# Altium project MSE-Interface-N1.PrjPcb (part 1 of 2)
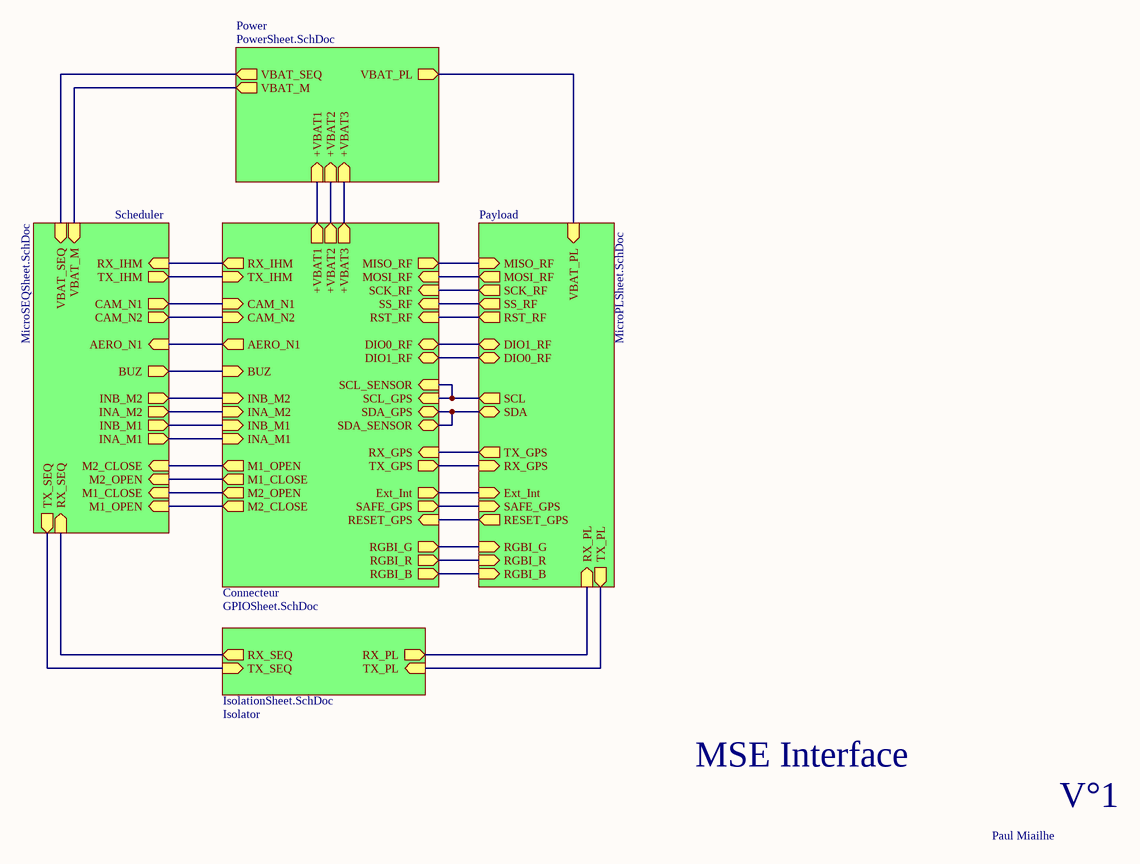
[diagram p0: MainSheet.SchDoc]
6 sheets, 73 parts. Net scope: hierarchical (ports join the sheet entries above them; power ports are global).
Board file: MSE-PCB-N1.PcbDoc
Sheets:
  MainSheet.SchDoc
    Payload = MicroPLSheet.SchDoc
    Connecteur = GPIOSheet.SchDoc
    Power = PowerSheet.SchDoc
    Scheduler = MicroSEQSheet.SchDoc
    Isolator = IsolationSheet.SchDoc

## Sheet MainSheet.SchDoc
size A4; SheetNumber: 1; SheetTotal: 6

### Sub-sheets
Connecteur = GPIOSheet.SchDoc: INA_M1 (in), INB_M1 (in), INA_M2 (in), INB_M2 (in), M1_OPEN (out), M1_CLOSE (out), M2_OPEN (out), M2_CLOSE (out), BUZ (in), +VBAT1 (out), +VBAT3 (out), +VBAT2 (out), AERO_N1 (out), SS_RF (in), RX_GPS (in), Ext_Int (out), SAFE_GPS (out), RESET_GPS (in), MISO_RF (out), MOSI_RF (in), RST_RF (in), SCK_RF (in), DIO0_RF (bidir), DIO1_RF (bidir), TX_GPS (out), SDA_GPS (bidir), SCL_GPS (in), RX_IHM (out), TX_IHM (in), CAM_N1 (in), CAM_N2 (in), SDA_SENSOR (bidir), SCL_SENSOR (in), RGBI_G (out), RGBI_R (out), RGBI_B (out)
Isolator = IsolationSheet.SchDoc: RX_PL (out), TX_PL (in), RX_SEQ (out), TX_SEQ (in)
Payload = MicroPLSheet.SchDoc: SS_RF (out), RX_GPS (in), Ext_Int (in), SAFE_GPS (in), RESET_GPS (out), MISO_RF (in), MOSI_RF (out), RST_RF (out), SCK_RF (out), DIO0_RF (bidir), DIO1_RF (bidir), TX_GPS (out), SDA (bidir), SCL (out), VBAT_PL (in), RX_PL (in), TX_PL (out), RGBI_G (in), RGBI_R (in), RGBI_B (in)
Power = PowerSheet.SchDoc: VBAT_SEQ (out), +VBAT1 (in), +VBAT3 (in), VBAT_PL (out), +VBAT2 (in), VBAT_M (out)
Scheduler = MicroSEQSheet.SchDoc: M1_OPEN (in), M1_CLOSE (in), M2_OPEN (in), M2_CLOSE (in), BUZ (out), INA_M1 (out), INB_M1 (out), INA_M2 (out), INB_M2 (out), VBAT_SEQ (in), VBAT_M (in), AERO_N1 (in), RX_SEQ (in), TX_SEQ (out), CAM_N1 (out), CAM_N2 (out), RX_IHM (in), TX_IHM (out)

### Nets
SCL: sheet Payload/SCL, sheet Connecteur/SCL_GPS, sheet Connecteur/SCL_SENSOR
SDA: sheet Payload/SDA, sheet Connecteur/SDA_GPS, sheet Connecteur/SDA_SENSOR
NetC1_2: sheet Power/VBAT_SEQ, sheet Scheduler/VBAT_SEQ
NetC3_2: sheet Payload/VBAT_PL, sheet Power/VBAT_PL
NetC7_2: sheet Power/VBAT_M, sheet Scheduler/VBAT_M
NetF1_1: sheet Connecteur/+VBAT1, sheet Power/+VBAT1
NetF2_1: sheet Connecteur/+VBAT2, sheet Power/+VBAT2
NetF3_1: sheet Connecteur/+VBAT3, sheet Power/+VBAT3
NetJ1_01: sheet Scheduler/TX_SEQ, sheet Isolator/TX_SEQ
NetJ1_02: sheet Scheduler/RX_SEQ, sheet Isolator/RX_SEQ
NetJ1_04: sheet Connecteur/CAM_N2, sheet Scheduler/CAM_N2
NetJ1_05: sheet Connecteur/CAM_N1, sheet Scheduler/CAM_N1
NetJ1_11: sheet Connecteur/TX_IHM, sheet Scheduler/TX_IHM
NetJ1_12: sheet Connecteur/RX_IHM, sheet Scheduler/RX_IHM
NetJ1_14: sheet Connecteur/BUZ, sheet Scheduler/BUZ
NetJ1_15: sheet Connecteur/M2_CLOSE, sheet Scheduler/M1_OPEN
NetJ1_16: sheet Connecteur/M2_OPEN, sheet Scheduler/M1_CLOSE
NetJ1_17: sheet Connecteur/M1_CLOSE, sheet Scheduler/M2_OPEN
NetJ1_19: sheet Connecteur/M1_OPEN, sheet Scheduler/M2_CLOSE
NetJ2_01: sheet Connecteur/INA_M1, sheet Scheduler/INA_M1
NetJ2_02: sheet Connecteur/INB_M1, sheet Scheduler/INB_M1
NetJ2_04: sheet Connecteur/INA_M2, sheet Scheduler/INA_M2
NetJ2_05: sheet Connecteur/INB_M2, sheet Scheduler/INB_M2
NetJ3_01: sheet Payload/TX_PL, sheet Isolator/TX_PL
NetJ3_02: sheet Payload/RX_PL, sheet Isolator/RX_PL
NetJ3_04: sheet Payload/DIO1_RF, sheet Connecteur/DIO0_RF
NetJ3_05: sheet Payload/DIO0_RF, sheet Connecteur/DIO1_RF
NetJ3_11: sheet Payload/TX_GPS, sheet Connecteur/RX_GPS
NetJ3_12: sheet Payload/RX_GPS, sheet Connecteur/TX_GPS
NetJ3_14: sheet Payload/SCK_RF, sheet Connecteur/SCK_RF
NetJ3_15: sheet Payload/MOSI_RF, sheet Connecteur/MOSI_RF
NetJ3_16: sheet Payload/MISO_RF, sheet Connecteur/MISO_RF
NetJ3_17: sheet Payload/SS_RF, sheet Connecteur/SS_RF
NetJ3_19: sheet Payload/RST_RF, sheet Connecteur/RST_RF
NetJ4_01: sheet Payload/RGBI_R, sheet Connecteur/RGBI_R
NetJ4_02: sheet Payload/RGBI_G, sheet Connecteur/RGBI_G
NetJ4_04: sheet Payload/RGBI_B, sheet Connecteur/RGBI_B
NetJ4_05: sheet Payload/RESET_GPS, sheet Connecteur/RESET_GPS
NetJ4_11: sheet Payload/Ext_Int, sheet Connecteur/Ext_Int
NetJ4_12: sheet Payload/SAFE_GPS, sheet Connecteur/SAFE_GPS
NetR19_1: sheet Connecteur/AERO_N1, sheet Scheduler/AERO_N1

### Notes on the sheet
- MSE Interface
- V°1
- Paul Miailhe

## Sheet MicroPLSheet.SchDoc
size A4; SheetNumber: 2; SheetTotal: 6
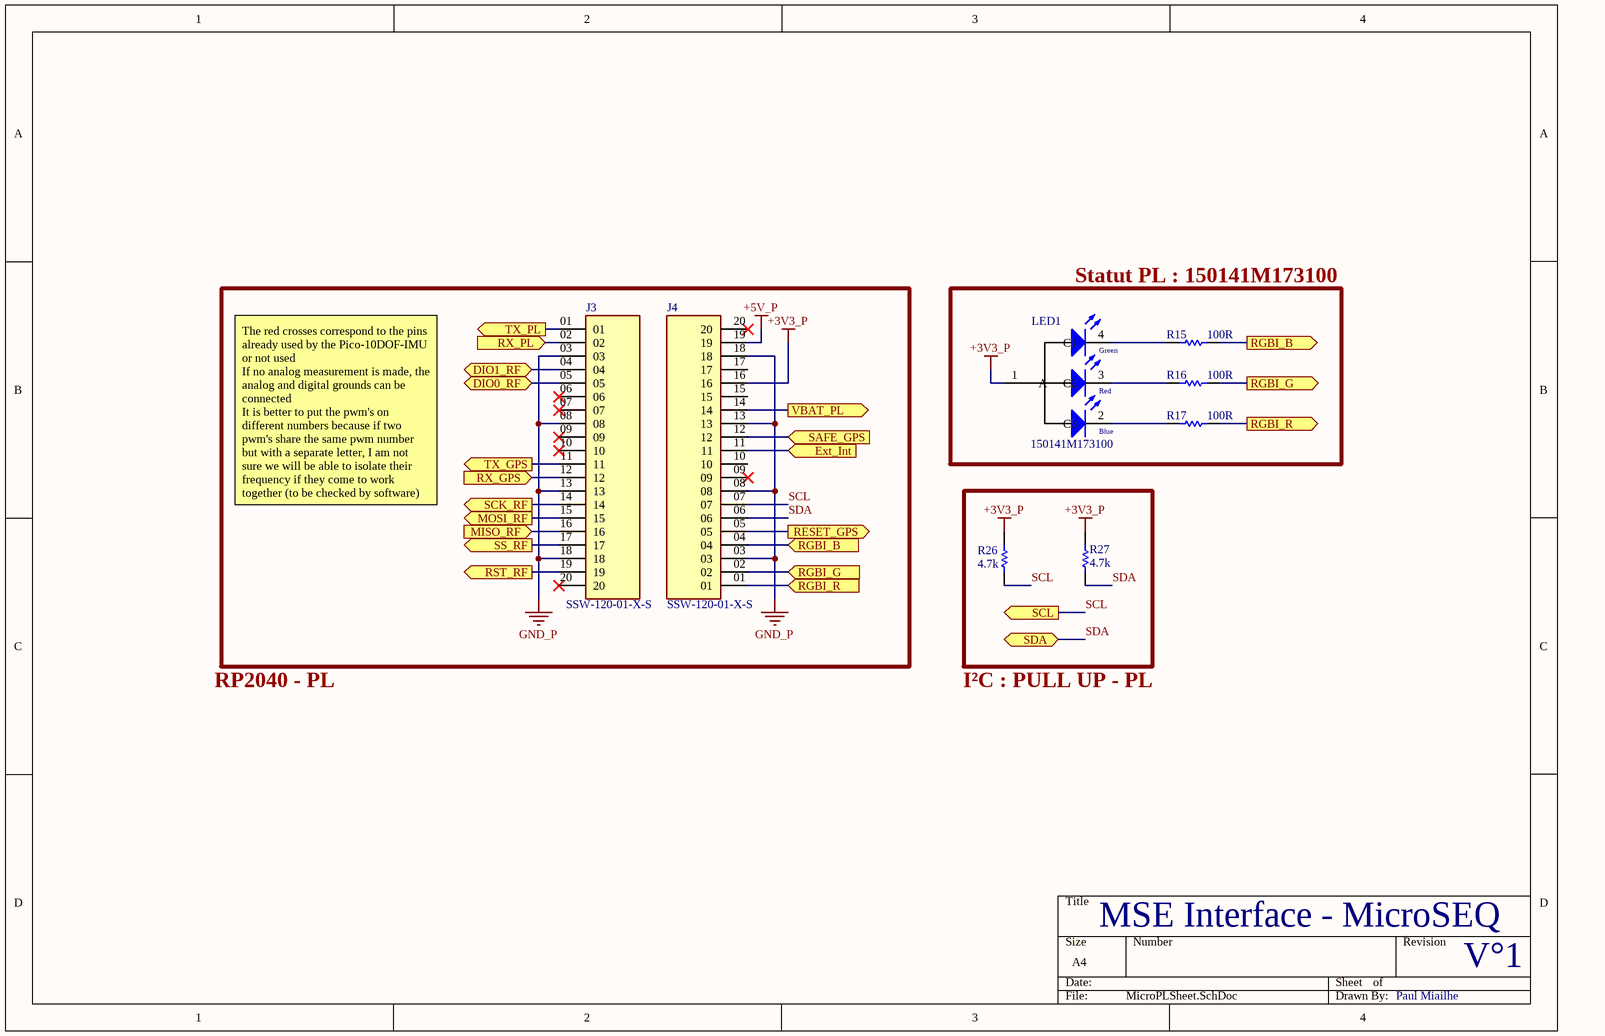
[diagram p1: MicroPLSheet.SchDoc]

### Parts
J3  SSW-120-01-X-S  [SAMTEC_SSW-120-01-X-S]
J4  SSW-120-01-X-S  [SAMTEC_SSW-120-01-X-S]
LED1  150141M173100  [3528_A]
R15  Resistance: 100R  [RESC1608X55X30LL15T15]  (hidden comment: ERJ-3EKF1000V)
R16  Resistance: 100R  [RESC1608X55X30LL15T15]  (hidden comment: ERJ-3EKF1000V)
R17  Resistance: 100R  [RESC1608X55X30LL15T15]  (hidden comment: ERJ-3EKF1000V)
R26  Resistance: 4.7k  [RESC1608X55X25LL10T15]  (hidden comment: RC0603FR-074K7L)
R27  Resistance: 4.7k  [RESC1608X55X25LL10T15]  (hidden comment: RC0603FR-074K7L)

### Blocks framed on the sheet
Statut PL : 150141M173100: LED1 R15-R17

### Ports
DIO0_RF (bidir, see MainSheet[3C]), DIO1_RF (bidir, see MainSheet[3B]), Ext_Int (in, see MainSheet[3C], GPIOSheet[1B]), MISO_RF (in, see MainSheet[3B], GPIOSheet[1B]), MOSI_RF (out, see MainSheet[3B], GPIOSheet[1B]), RESET_GPS (out, see MainSheet[3C], GPIOSheet[1B]), RGBI_B (in, see MainSheet[3C], GPIOSheet[3C]), RGBI_B (out, see MainSheet[3C], GPIOSheet[3C]), RGBI_G (in, see MainSheet[3C], GPIOSheet[4C]), RGBI_G (out, see MainSheet[3C], GPIOSheet[4C]), RGBI_R (in, see MainSheet[3C], GPIOSheet[4C]), RGBI_R (out, see MainSheet[3C], GPIOSheet[4C]), RST_RF (out, see MainSheet[3B], GPIOSheet[1B]), RX_GPS (in, see MainSheet[3C]), RX_PL (in, see MainSheet[3C], IsolationSheet[2B]), SAFE_GPS (in, see MainSheet[3C], GPIOSheet[1B]), SCK_RF (out, see MainSheet[3B], GPIOSheet[1B]), SCL (out, see MainSheet[3C]), SDA (bidir, see MainSheet[3C]), SS_RF (out, see MainSheet[3B], GPIOSheet[1B]), TX_GPS (out, see MainSheet[3C]), TX_PL (out, see MainSheet[3C], IsolationSheet[2B]), VBAT_PL (out, see MainSheet[3B], PowerSheet[2C])

### Nets
+3V3_P: J4.16 LED1.1(A) R26.2 R27.2
+5V_P: J4.19
GND_P: J3.03 J3.08 J3.13 J3.18 J4.03 J4.08 J4.13 J4.18
SCL: J4.07 R26.1 ; port SCL
SDA: J4.06 R27.1 ; port SDA
NetC3_2: J4.14 ; port VBAT_PL
NetJ3_01: J3.01 ; port TX_PL
NetJ3_02: J3.02 ; port RX_PL
NetJ3_04: J3.04 ; port DIO1_RF
NetJ3_05: J3.05 ; port DIO0_RF
NetJ3_11: J3.11 ; port TX_GPS
NetJ3_12: J3.12 ; port RX_GPS
NetJ3_14: J3.14 ; port SCK_RF
NetJ3_15: J3.15 ; port MOSI_RF
NetJ3_16: J3.16 ; port MISO_RF
NetJ3_17: J3.17 ; port SS_RF
NetJ3_19: J3.19 ; port RST_RF
NetJ4_01: J4.01 R17.1 ; port RGBI_R
NetJ4_02: J4.02 R16.1 ; port RGBI_G
NetJ4_04: J4.04 R15.1 ; port RGBI_B
NetJ4_05: J4.05 ; port RESET_GPS
NetJ4_11: J4.11 ; port Ext_Int
NetJ4_12: J4.12 ; port SAFE_GPS
NetLED1_2: LED1.2(C3) R17.2
NetLED1_3: LED1.3(C2) R16.2
NetLED1_4: LED1.4(C1) R15.2

Not connected (* = marked no-connect by the designer): J3 06* 07* 09* 10* 20*; J4 09* 10 15 17 20*

### Notes on the sheet
- The red crosses correspond to the pins already used by the Pico-10DOF-IMU or not used
  If no analog measurement is made, the analog and digital grounds can be connected
  It is better to put the pwm's on different numbers because if two pwm's share the same pwm number but with a separate letter, I am not sure we will be able to isolate their frequency if they come to work together (to be checked by software)
- RP2040 - PL
- I²C : PULL UP - PL
- MSE Interface - MicroSEQ
- V°1
- Paul Miailhe
- (in symbol CMP-1431-00001-1) Green; Red; Blue

### Library data of the parts
J3 J4 = CMP-011-000000-2: SSW - Samtec 2.54mm Single Row Straight Socket Strip 8.5 Profile - Fast Stock; MP: SSW-120-01-G-S; Value: *; Check_prices: https://www.snapeda.com/parts/SSW-120-01-G-S/Samtec/view-part/598388/?ref=eda; Price: None; Design Item ID: SSW-120-01-X-S; SnapEDA_Link: https://www.snapeda.com/parts/SSW-120-01-G-S/Samtec/view-part/598388/?ref=snap; Component Type: Standard; MF: Samtec; Source: SSW-120-01-X-S.SchLib; Package: None; Pin Count: 20; Availability: Bad; Purchase-URL: https://pricing.snapeda.com/search/part/SSW-120-01-G-S/?ref=eda
LED1 = CMP-1431-00001-1: SMD Full-Color Top LED, WL-SFTW, Red & Green & Blue; Manufacturer: Wuerth Elektronik; PackageReference: 3528_A; PartNumber: 150141M173100; ComponentLink2Description: Datasheet; ComponentLink1URL: http://www.we-online.com; Color: Red & Green & Blue; ComponentLink1Description: Manufacturer URL; ComponentLink2URL: http://katalog.we-online.com/led/datasheet/150141M173100.pdf
R15-R17 = CMP-2000-00179-1: Manufacturer: Panasonic; Manufacturer Part Number: ERJ3EKF1000V; Tolerance: 1%; Power Rating: 100mW; Voltage Rating: 75V; Temperature Coefficient: 100ppm/°C; Part Number: ERJ-3EKF1000V; Supplier 1: RSComponents; Supplier Part Number 1: 1755733; RoHS: Yes; Category: Chip SMD Resistors; Stock 1: 30000; Pricing 1: 5000=0,01000, 10000=0,00800, 15000=0,00800, 20000=0,00800, 5000=0,00700, 10000=0,00600, 15000=0,00600, 20000=0,00600 (USD); Mount: Surface Mount; Number of Pins: 2; Case Code (Imperial): 0603; Case Code (Metric): 1608; Weight: 7.1E-05oz; Contact Plating: Tin; Size Code: 0603; Min Operating Temperature: -55°C; Max Operating Temperature: 155°C; Packaging: Tape and Reel; Termination: SMD/SMT; Resistor Type: Thick Film; Number of Terminations: 2; Series: ERJ; Package Quantity: 5000; Max Power Dissipation: 100mW; Voltage Rating (DC): 75V; Resistance Tolerance: 1%; Construction: Rectangular; Features: Automotive AEC-Q200; Length: 1.6mm; Width: 0.8mm; Height: 0.45mm; Depth: 0.8mm; Radiation Hardening: No; REACH SVHC: No SVHC; RoHS Compliant: Yes; Military Standard: Not; Lead Free: Lead Free; ComponentLink1URL: https://datasheet.ciiva.com/34303/1987450-34303565.pdf?src-supplier=Jameco; ComponentLink1Description: https://datasheet.ciiva.com/34303/1987450-34303565.pdf?src-supplier=Jameco; ComponentLink2URL: https://datasheet.ciiva.com/7830/aoa0000ce2-7830728.pdf?src-supplier=Element14; ComponentLink2Description: https://datasheet.ciiva.com/7830/aoa0000ce2-7830728.pdf?src-supplier=Element14; ComponentLink3URL: https://datasheet.ciiva.com/46372/1678782-46372726.pdf?src-supplier=Element14; ComponentLink3Description: https://datasheet.ciiva.com/46372/1678782-46372726.pdf?src-supplier=Element14; ComponentLink4URL: https://datasheet.ciiva.com/22667/1678782-22667887.pdf?src-supplier=Element14; ComponentLink4Description: https://datasheet.ciiva.com/22667/1678782-22667887.pdf?src-supplier=Element14; ComponentLink5URL: https://datasheet.ciiva.com/46372/1678782-46372727.pdf?src-supplier=Element14; ComponentLink5Description: https://datasheet.ciiva.com/46372/1678782-46372727.pdf?src-supplier=Element14; ComponentLink6URL: https://datasheet.ciiva.com/24159/aoa0000ce2-24159753.pdf?src-supplier=Mouser; ComponentLink6Description: https://datasheet.ciiva.com/24159/aoa0000ce2-24159753.pdf?src-supplier=Mouser; ComponentLink7URL: https://datasheet.ciiva.com/16762/70260748-16762666.pdf?src-supplier=Allied+Electronics; ComponentLink7Description: https://datasheet.ciiva.com/16762/70260748-16762666.pdf?src-supplier=Allied+Electronics; ComponentLink8URL: https://datasheet.ciiva.com/16765/70260748-16765766.pdf?src-supplier=Allied+Electronics; ComponentLink8Description: https://datasheet.ciiva.com/16765/70260748-16765766.pdf?src-supplier=Allied+Electronics; ComponentLink9URL: https://datasheet.ciiva.com/9186/aoa0000ce2-9186725.pdf?src-supplier=Avnet; ComponentLink9Description: https://datasheet.ciiva.com/9186/aoa0000ce2-9186725.pdf?src-supplier=Avnet; ComponentLink10URL: https://datasheet.ciiva.com/48530/aoa0000ce2-48530986.pdf?src-supplier=Avnet; ComponentLink10Description: https://datasheet.ciiva.com/48530/aoa0000ce2-48530986.pdf?src-supplier=Avnet; ComponentLink11URL: https://datasheet.ciiva.com/30088/aoa0000ce2-30088649.pdf?src-supplier=Onlinecomponents.com; ComponentLink11Description: https://datasheet.ciiva.com/30088/aoa0000ce2-30088649.pdf?src-supplier=Onlinecomponents.com; ComponentLink12URL: https://datasheet.ciiva.com/17207/aoa0000ce2-17207983.pdf?src-supplier=Avnet+Europe; ComponentLink12Description: https://datasheet.ciiva.com/17207/aoa0000ce2-17207983.pdf?src-supplier=Avnet+Europe
R26 R27 = CMP-2000-06942-1: Chip Resistor, 4.7 KOhm, +/- 1%, 0.1 W, -55 to 155 degC, 0603 (1608 Metric), RoHS, Tape and Reel; Manufacturer: Yageo; Power Rating: 100mW; Temperature Coefficient: 100PPM/C; Voltage Rating: 50V; Package Reference: 0603; Series: RC; Datasheet Version: Rev. 7, 05/2017; Packaging: Reel; Termination Style: SMD/SMT; Datasheet URL: http://www.yageo.com/documents/recent/PYu-RC_Group_51_RoHS_L_7.pdf; Manufacturer URL: http://www.yageo.com/; Package Description: 2-Pin Surface Mount Device, Body 1.6 x 0.8 mm; Case Code - mm: 1608; Mounting Technology: SurfaceMount; Operating Temperature Range: -55Cto+155C; Tolerance: 1%; Product: ThickFilmResistorsGeneralPurpose; Supplier 1: Mouser; Supplier Part Number 1: 603-RC0603FR-074K7L; Manufacturer Part Number: RC0603FR-074K7L; RoHS: Yes; Category: Chip SMD Resistors; Stock 1: 772810; Pricing 1: 1=0,10000, 10=0,02400, 50=0,02400, 100=0,01000, 1000=0,00400, 5000=0,00300, 10000=0,00300 (USD); Case/Package: 0603; Number of Pins: 2; Case Code (Imperial): 0603; Case Code (Metric): 1608; Size Code: 0603; Min Operating Temperature: -55°C; Max Operating Temperature: 155°C; Voltage Rating (DC): 50V; Termination: SMD/SMT; Resistor Type: Thick Film; Features: Moisture Resistant; Max Power Dissipation: 100mW; Number of Terminations: 2; Construction: Rectangular; Resistance Tolerance: 1%; Length: 1.6mm; Width: 0.8mm; Height: 0.45mm; Depth: 0.8mm; Lead Pitch: 0.3mm; REACH SVHC: No SVHC; Military Standard: Not; Lead Free: Lead Free; RoHS Compliant: Yes; ComponentLink1URL: https://datasheet.ciiva.com/15189/getdatasheetpartid-422754-15189760.pdf?src-supplier=Verical; ComponentLink1Description: https://datasheet.ciiva.com/15189/getdatasheetpartid-422754-15189760.pdf?src-supplier=Verical; ComponentLink2URL: https://datasheet.ciiva.com/22747/443971-22747528.pdf?src-supplier=Element14; ComponentLink2Description: https://datasheet.ciiva.com/22747/443971-22747528.pdf?src-supplier=Element14; ComponentLink3URL: https://datasheet.ciiva.com/7660/38590-7660794.pdf?src-supplier=Element14; ComponentLink3Description: https://datasheet.ciiva.com/7660/38590-7660794.pdf?src-supplier=Element14; ComponentLink4URL: https://datasheet.ciiva.com/7746/1868787-7746365.pdf?src-supplier=Element14; ComponentLink4Description: https://datasheet.ciiva.com/7746/1868787-7746365.pdf?src-supplier=Element14; ComponentLink5URL: https://datasheet.ciiva.com/46440/1868787-46440909.pdf?src-supplier=Element14; ComponentLink5Description: https://datasheet.ciiva.com/46440/1868787-46440909.pdf?src-supplier=Element14; ComponentLink6URL: https://datasheet.ciiva.com/7746/1738695-7746366.pdf?src-supplier=Element14; ComponentLink6Description: https://datasheet.ciiva.com/7746/1738695-7746366.pdf?src-supplier=Element14

## Sheet GPIOSheet.SchDoc
size A4; SheetNumber: 4; SheetTotal: 6
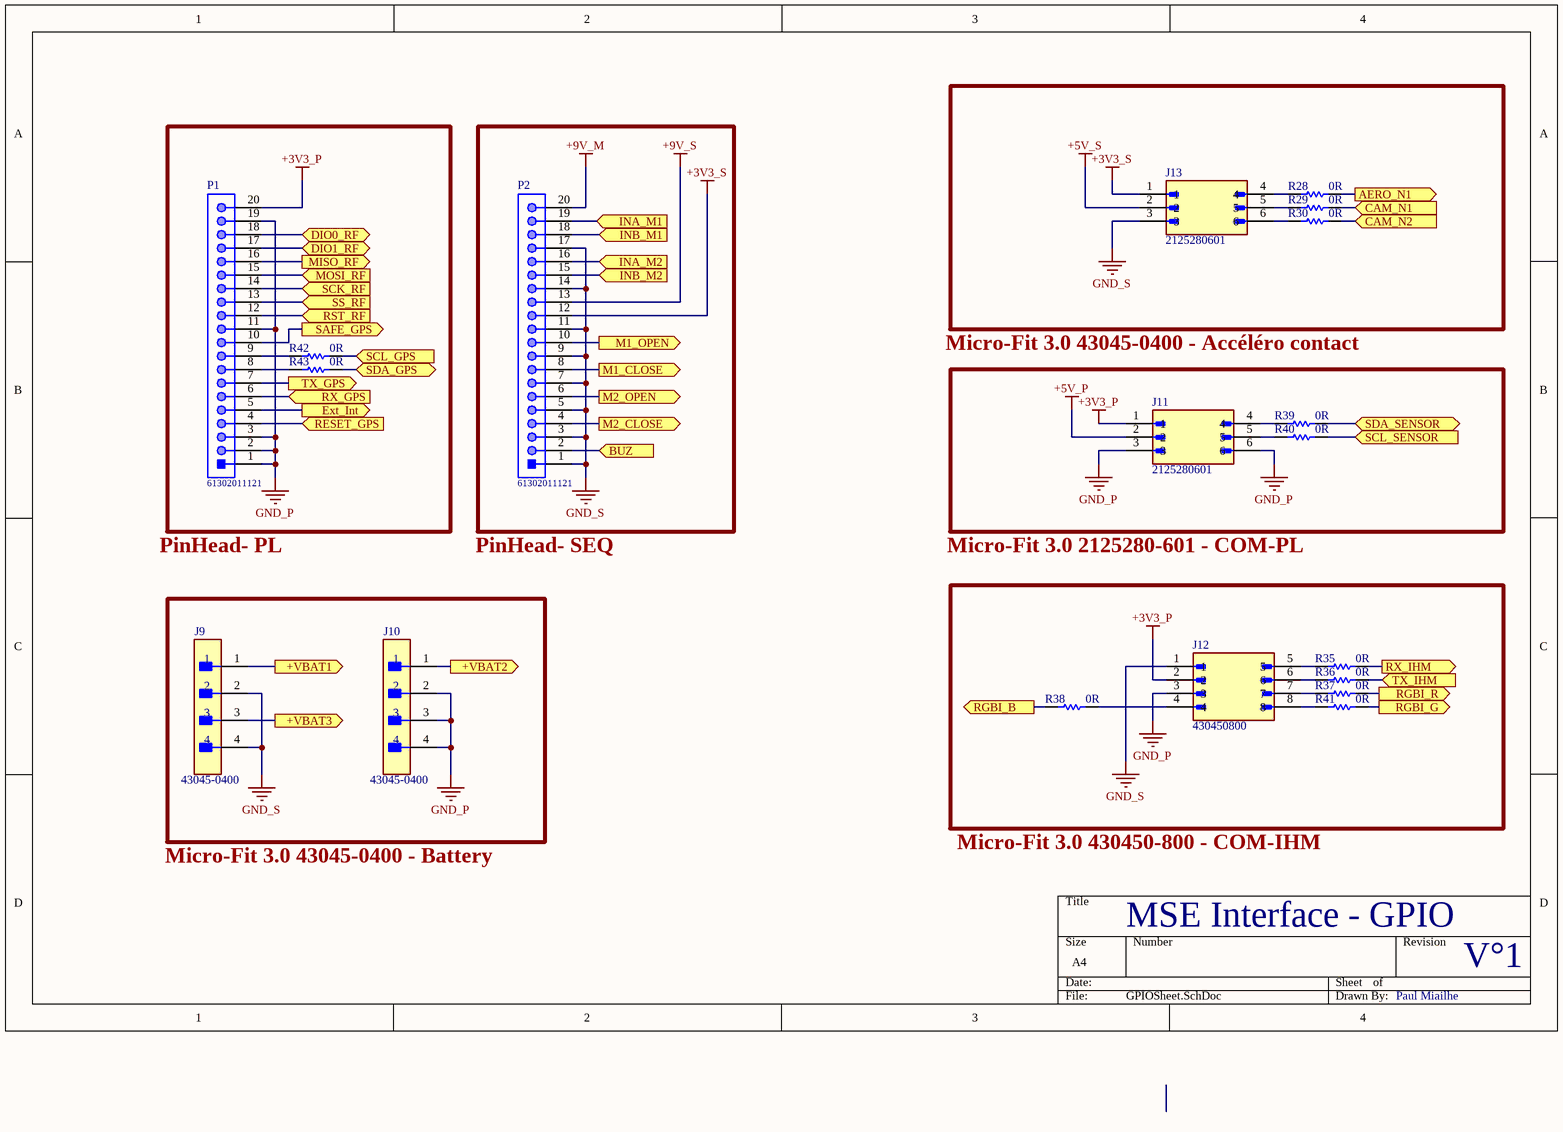
[diagram p2: GPIOSheet.SchDoc]

### Parts
J9  43045-0400  [FP-43045-0400-MFG]
J10  43045-0400  [FP-43045-0400-MFG]
J11  2125280601  [MOLEX_2125280601]
J12  430450800  [MOLEX_430450800]
J13  2125280601  [MOLEX_2125280601]
P1  61302011121  [61302011121]
P2  61302011121  [61302011121]
R28  0R  [RESC1608X55X25ML10T15]
R29  0R  [RESC1608X55X25ML10T15]
R30  0R  [RESC1608X55X25ML10T15]
R35  0R  [RESC1608X55X25ML10T15]
R36  0R  [RESC1608X55X25ML10T15]
R37  0R  [RESC1608X55X25ML10T15]
R38  0R  [RESC1608X55X25ML10T15]
R39  0R  [RESC1608X55X25ML10T15]
R40  0R  [RESC1608X55X25ML10T15]
R41  0R  [RESC1608X55X25ML10T15]
R42  0R  [RESC1608X55X25ML10T15]
R43  0R  [RESC1608X55X25ML10T15]

### Ports
+VBAT1 (out, see MainSheet[2B], PowerSheet[1A]), +VBAT2 (out, see MainSheet[2B], PowerSheet[1C]), +VBAT3 (out, see MainSheet[2B], PowerSheet[3A]), AERO_N1 (out, see MainSheet[2B], MicroSEQSheet[3B]), BUZ (in, see MainSheet[2C], MicroSEQSheet[1B]), CAM_N1 (in, see MainSheet[2B], MicroSEQSheet[1B]), CAM_N2 (in, see MainSheet[2B], MicroSEQSheet[1B]), DIO0_RF (bidir, see MainSheet[3B]), DIO1_RF (bidir, see MainSheet[3C]), Ext_Int (out, see MainSheet[3C], MicroPLSheet[3B]), INA_M1 (in, see MainSheet[2C], MicroSEQSheet[2C]), INA_M2 (in, see MainSheet[2C], MicroSEQSheet[2C]), INB_M1 (in, see MainSheet[2C], MicroSEQSheet[2C]), INB_M2 (in, see MainSheet[2C], MicroSEQSheet[2B]), M1_CLOSE (out, see MainSheet[2C]), M1_OPEN (out, see MainSheet[2C]), M2_CLOSE (out, see MainSheet[2C]), M2_OPEN (out, see MainSheet[2C]), MISO_RF (out, see MainSheet[3B], MicroPLSheet[2C]), MOSI_RF (in, see MainSheet[3B], MicroPLSheet[2C]), RESET_GPS (in, see MainSheet[3C], MicroPLSheet[3C]), RGBI_B (out, see MainSheet[3C], MicroPLSheet[3C], MicroPLSheet[4B]), RGBI_G (out, see MainSheet[3C], MicroPLSheet[3C], MicroPLSheet[4B]), RGBI_R (out, see MainSheet[3C], MicroPLSheet[3C], MicroPLSheet[4B]), RST_RF (in, see MainSheet[3B], MicroPLSheet[2C]), RX_GPS (in, see MainSheet[3C]), RX_IHM (out, see MainSheet[2B], MicroSEQSheet[1B]), SAFE_GPS (out, see MainSheet[3C], MicroPLSheet[3B]), SCK_RF (in, see MainSheet[3B], MicroPLSheet[2B]), SCL_GPS (in, see MainSheet[3C]), SCL_SENSOR (in, see MainSheet[3C]), SDA_GPS (bidir, see MainSheet[3C]), SDA_SENSOR (bidir, see MainSheet[3C]), SS_RF (in, see MainSheet[3B], MicroPLSheet[2C]), TX_GPS (out, see MainSheet[3C]), TX_IHM (in, see MainSheet[2B], MicroSEQSheet[1B])

### Nets
+3V3_P: J11.1 J12.2 P1.20
+3V3_S: J13.1 P2.12
+5V_P: J11.2
+5V_S: J13.2
+9V_M: P2.20
+9V_S: P2.13
GND_P: J10.2 J10.3 J10.4 J11.3 J11.6 J12.3 P1.1 P1.2 P1.3 P1.11 P1.19
GND_S: J9.2 J9.4 J12.1 J13.3 P2.1 P2.3 P2.5 P2.7 P2.9 P2.11 P2.14 P2.17
SCL: R40.2 R42.2 ; port SCL_SENSOR, port SCL_GPS
SDA: R39.2 R43.2 ; port SDA_SENSOR, port SDA_GPS
NetF1_1: J9.1 ; port +VBAT1
NetF2_1: J10.1 ; port +VBAT2
NetF3_1: J9.3 ; port +VBAT3
NetJ1_04: R30.2 ; port CAM_N2
NetJ1_05: R29.2 ; port CAM_N1
NetJ1_11: R36.2 ; port TX_IHM
NetJ1_12: R35.2 ; port RX_IHM
NetJ1_14: P2.2 ; port BUZ
NetJ1_15: P2.4 ; port M2_CLOSE
NetJ1_16: P2.6 ; port M2_OPEN
NetJ1_17: P2.8 ; port M1_CLOSE
NetJ1_19: P2.10 ; port M1_OPEN
NetJ2_01: P2.19 ; port INA_M1
NetJ2_02: P2.18 ; port INB_M1
NetJ2_04: P2.16 ; port INA_M2
NetJ2_05: P2.15 ; port INB_M2
NetJ3_04: P1.18 ; port DIO0_RF
NetJ3_05: P1.17 ; port DIO1_RF
NetJ3_11: P1.6 ; port RX_GPS
NetJ3_12: P1.7 ; port TX_GPS
NetJ3_14: P1.14 ; port SCK_RF
NetJ3_15: P1.15 ; port MOSI_RF
NetJ3_16: P1.16 ; port MISO_RF
NetJ3_17: P1.13 ; port SS_RF
NetJ3_19: P1.12 ; port RST_RF
NetJ4_01: R37.1 ; port RGBI_R
NetJ4_02: R41.1 ; port RGBI_G
NetJ4_04: R38.1 ; port RGBI_B
NetJ4_05: P1.4 ; port RESET_GPS
NetJ4_11: P1.5 ; port Ext_Int
NetJ4_12: P1.10 ; port SAFE_GPS
NetJ11_4: J11.4 R39.1
NetJ11_5: J11.5 R40.1
NetJ12_4: J12.4 R38.2
NetJ12_5: J12.5 R35.1
NetJ12_6: J12.6 R36.1
NetJ12_7: J12.7 R37.2
NetJ12_8: J12.8 R41.2
NetJ13_4: J13.4 R28.1
NetJ13_5: J13.5 R29.1
NetJ13_6: J13.6 R30.1
NetP1_8: P1.8 R43.1
NetP1_9: P1.9 R42.1
NetR19_1: R28.2 ; port AERO_N1

### Notes on the sheet
- Micro-Fit 3.0 43045-0400 - Accéléro contact
- PinHead- PL
- PinHead- SEQ
- Micro-Fit 3.0 2125280-601 - COM-PL
- Micro-Fit 3.0 43045-0400 - Battery
- Micro-Fit 3.0 430450-800 - COM-IHM
- MSE Interface - GPIO
- V°1
- Paul Miailhe

### Library data of the parts
J9 J10 = CMP-04776-000002-1: CONN HEADER R/A 4POS 3MM; Manufacturer: Molex; Conn Gender: Male; Conn Orientation: Right Angle; Voltage Rating: 600V; Number Of Contacts: 4; Is Female: yes; Current Rating: 8.5A; ComponentLink2URL: https://www.molex.com/webdocs/datasheets/pdf/en-us/0430450400_PCB_HEADERS.pdf; Manufacturer Part Number: 43045-0400; Digikey Description: CONN HEADER R/A 4POS 3MM; Category: Conn; Temperature Range High: +105°C; Lead Free: Yes; Device Class L1: Connectors; Automotive: No; Temperature: -40°C to +105°C; Footprint Url: https://www.molex.com/pdm_docs/sd/430450400_sd.pdf; Height: 9.27mm; Number Of Rows: 2; Device Class L3: unset; Pitch: 3mm; Temperature Range Low: -40°C; Contact Material: Tin,Nickel; Octopart: https://octopart.com/43045-0400-molex-287063; RoHS: TRUE; ComponentLink2Description: Datasheet; Package: 43045-0400; Device Class L2: Headers and Wire Housings
J11 J13 = CMP-013-000000-2: Connector Header Through Hole, Right Angle 6 position 0.118 (3.00mm); MF: Molex; MP: 2125280601; Package: None; Design Item ID: 2125280601; Source: 2125280601.SchLib; Price: None; SnapEDA_Link: https://www.snapeda.com/parts/2125280601/Molex/view-part/?ref=snap; Availability: In Stock; Component Type: Standard; Value: *; Pin Count: 6; Purchase-URL: https://pricing.snapeda.com/search/part/2125280601/?ref=eda; Check_prices: https://www.snapeda.com/parts/2125280601/Molex/view-part/?ref=eda
J12 = CMP-015-000000-4: Connector Header Through Hole, Right Angle 8 position 0.118 (3.00mm); MF: Molex; MP: 43045-0800; Pin Count: 8; Purchase-URL: https://pricing.snapeda.com/search/part/43045-0800/?ref=eda; SnapEDA_Link: https://www.snapeda.com/parts/43045-0800/Molex/view-part/?ref=snap; Component Type: Standard; Price: None; Design Item ID: 430450800; Source: 430450800.SchLib; Check_prices: https://www.snapeda.com/parts/43045-0800/Molex/view-part/?ref=eda; Availability: In Stock; Value: *; Package: None
P1 P2 = CMP-1502-01102-1: THT Vertical Pin Header WR-PHD, Pitch 2.54 mm, Single Row, 20 pins; Manufacturer: Wurth Elektronik; Withstanding Voltage: 500VAC; Gender: Male; Pin Number: 20; Rated Current: 3A; Contact Resistance: 20mOhm; Pitch: 2.54mm; Working Voltage: 250VAC; Publisher: WurthElektronik; Packaging: Bag; Datasheet URL: https://katalog.we-online.de/em/datasheet/6130xx11121.pdf; Row Number: Single; Mounting Technology: THT; Manufacturer URL: http://www.we-online.de; Orientation: Vertical; Package Reference: 61302011121; Part Number: 61302011121; Operating Temperature: -40to105degC
R28-R30 R35-R43 = CMP-2100-03667-1: Chip Resistor, 0 Ohm, +/- 5%, 0.1 W, -55 to 155 degC, 0603 (1608 Metric), RoHS, Tape and Reel; Manufacturer: Yageo; Temperature Coefficient: 200ppm/degreesC; Voltage Rating: 50V; Power Rating: 100mW; Resistance: 0mOhm; Width: 0.8mm; Max Operating Temperature: 155degC; Tolerance: 5%; Package Reference: 0603; Height: 0.45mm; Depth: 0.8mm; Package Description: 2-Pin Surface Mount Device, Body 1.6 x 0.8 mm; Termination: SMD/SMT; Package Quantity: 5000; Case/Package: 0603; Case Code (Imperial): 0603; Radiation Hardening: No; Number of Pins: 2; Length: 1.6mm; Lead Free: LeadFree; Voltage Rating (DC): 50V; Military Standard: Not; Datasheet URL: http://www.yageo.com/NewPortal/yageodocoutput?fileName=/pdf/R-Chip/PYu-RC_Group_51_RoHS_L_5.pdf; Manufacturer URL: http://www.yageo.com/; Packaging: TapeandReel; Case Code (Metric): 1608; Min Operating Temperature: -55degC; Composition: ThickFilm; RoHSCompliant: true; Contact Plating: Tin; Datasheet Version: Rev. 5, 10/2016; REACH SVHC: NoSVHC

## Sheet PowerSheet.SchDoc
size A4; SheetNumber: 5; SheetTotal: 6
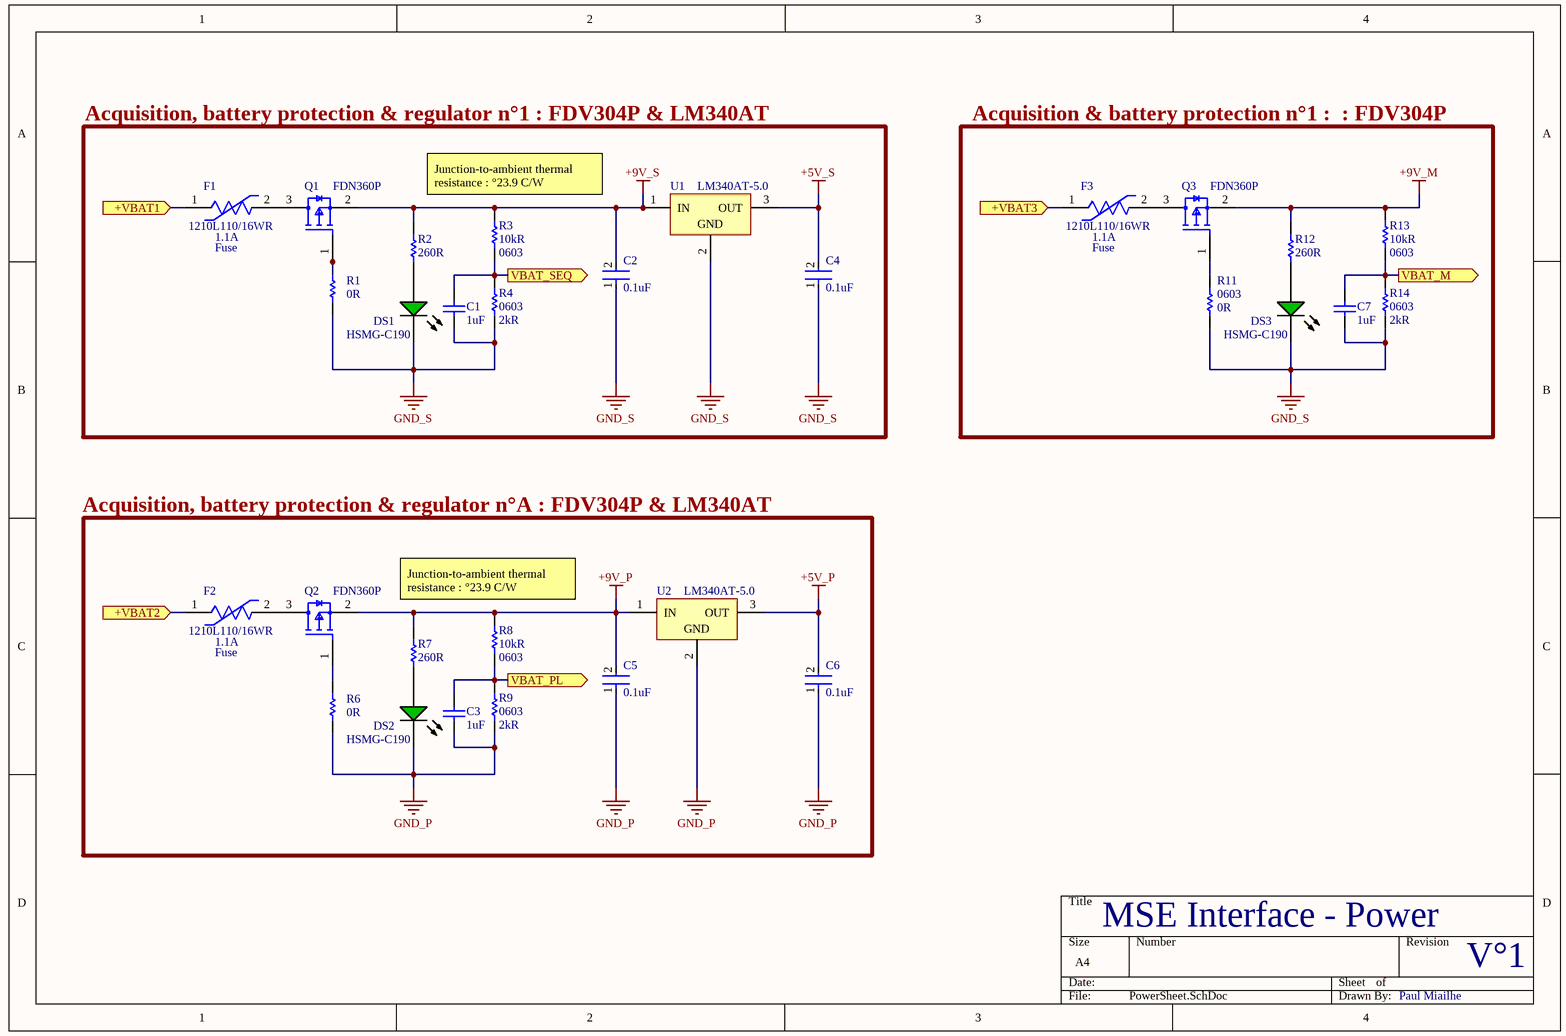
[diagram p3: PowerSheet.SchDoc]

### Parts
C1  Capacitance: 1uF  [CAPC1608X90X35LL10T15]  (hidden comment: GRM188R61E105KA12D)
C2  0.1uF  [FP-RCE1K1-2_5-MFG]
C3  Capacitance: 1uF  [CAPC1608X90X35LL10T15]  (hidden comment: GRM188R61E105KA12D)
C4  0.1uF  [FP-RCE1K1-2_5-MFG]
C5  0.1uF  [FP-RCE1K1-2_5-MFG]
C6  0.1uF  [FP-RCE1K1-2_5-MFG]
C7  Capacitance: 1uF  [CAPC1608X90X35LL10T15]  (hidden comment: GRM188R61E105KA12D)
DS1  HSMG-C190  [AVAG-HSMX-C190_V]
DS2  HSMG-C190  [AVAG-HSMX-C190_V]
DS3  HSMG-C190  [AVAG-HSMX-C190_V]
F1  1210L110/16WR  Hold Current: 1.1A  Category: Fuse  [FP-1210L110-16WR-MFG]
F2  1210L110/16WR  Hold Current: 1.1A  Category: Fuse  [FP-1210L110-16WR-MFG]
F3  1210L110/16WR  Hold Current: 1.1A  Category: Fuse  [FP-1210L110-16WR-MFG]
Q1  FDN360P  [FP-527AG-IPC_B]
Q2  FDN360P  [FP-527AG-IPC_B]
Q3  FDN360P  [FP-527AG-IPC_B]
R1  Resistance: 0R  [RESC1608X55X25ML10T15]  (hidden comment: RC0603JR-070RL)
R2  260R  [RESC1609X50X30NL8T20]  (no BOM)
R3  Resistance: 10kR  Case Code (Imperial): 0603  [RESC1609X55X30LL15T15]  (hidden comment: ERJ3EKF1002V)
R4  Case Code (Imperial): 0603  Resistance: 2kR  [RESC1608X55X30ML15T15]  (hidden comment: ERJ-3EKF2001V)
R6  Resistance: 0R  [RESC1608X55X25ML10T15]  (hidden comment: RC0603JR-070RL)
R7  260R  [RESC1609X50X30NL8T20]  (no BOM)
R8  Resistance: 10kR  Case Code (Imperial): 0603  [RESC1609X55X30LL15T15]  (hidden comment: ERJ3EKF1002V)
R9  Case Code (Imperial): 0603  Resistance: 2kR  [RESC1608X55X30ML15T15]  (hidden comment: ERJ-3EKF2001V)
R11  Package Reference: 0603  Resistance: 0R  [RESC1608X55X25ML10T15]  (hidden comment: RC0603JR-070RL)
R12  260R  [RESC1609X50X30NL8T20]  (no BOM)
R13  Resistance: 10kR  Case Code (Imperial): 0603  [RESC1609X55X30LL15T15]  (hidden comment: ERJ3EKF1002V)
R14  Case Code (Imperial): 0603  Resistance: 2kR  [RESC1608X55X30ML15T15]  (hidden comment: ERJ-3EKF2001V)
U1  LM340AT-5.0  [NDE0003A]
U2  LM340AT-5.0  [NDE0003A]

### Blocks framed on the sheet
Acquisition & battery protection n°1 :  : FDV304P: C7 DS3 F3 Q3 R11-R14

### Ports
+VBAT1 (in, see MainSheet[2B], GPIOSheet[1C]), +VBAT2 (in, see MainSheet[2B], GPIOSheet[2C]), +VBAT3 (in, see MainSheet[2B], GPIOSheet[1C]), VBAT_M (out, see MainSheet[2A], MicroSEQSheet[2B]), VBAT_PL (out, see MainSheet[3A], MicroPLSheet[3B]), VBAT_SEQ (out, see MainSheet[2A], MicroSEQSheet[2B])

### Nets
+5V_P: C6.2 U2.3(OUT)
+5V_S: C4.2 U1.3(OUT)
+9V_M: Q3.2(S) R12.1 R13.2
+9V_P: C5.2 Q2.2(S) R7.1 R8.2 U2.1(IN)
+9V_S: C2.2 Q1.2(S) R2.1 R3.2 U1.1(IN)
GND_P: C3.1 C5.1 C6.1 DS2.2(K) R6.1 R9.1 U2.2(GND)
GND_S: C1.1 C2.1 C4.1 C7.1 DS1.2(K) DS3.2(K) R1.1 R4.1 R11.1 R14.1 U1.2(GND)
NetC1_2: C1.2 R3.1 R4.2 ; port VBAT_SEQ
NetC3_2: C3.2 R8.1 R9.2 ; port VBAT_PL
NetC7_2: C7.2 R13.1 R14.2 ; port VBAT_M
NetDS1_1: DS1.1(A) R2.2
NetDS2_1: DS2.1(A) R7.2
NetDS3_1: DS3.1(A) R12.2
NetF1_1: F1.1 ; port +VBAT1
NetF1_2: F1.2 Q1.3(D)
NetF2_1: F2.1 ; port +VBAT2
NetF2_2: F2.2 Q2.3(D)
NetF3_1: F3.1 ; port +VBAT3
NetF3_2: F3.2 Q3.3(D)
NetQ1_1: Q1.1(G) R1.2
NetQ2_1: Q2.1(G) R6.2
NetQ3_1: Q3.1(G) R11.2

### Notes on the sheet
- Acquisition, battery protection & regulator n°1 : FDV304P & LM340AT
- Junction-to-ambient thermal resistance : °23.9 C/W
- Acquisition, battery protection & regulator n°A : FDV304P & LM340AT
- MSE Interface - Power
- V°1
- Paul Miailhe

### Library data of the parts
C1 C3 C7 = CMP-2006-02459-1: Manufacturer: Murata; Material: Ceramic; Tolerance: 10%; Voltage Rating: 25V; Dielectric: X5R; Part Number: GRM188R61E105KA12D; Supplier 1: Farnell; Supplier Part Number 1: 1828802; Manufacturer Part Number: GRM188R61E105KA12D; RoHS: Yes; Category: Ceramic Capacitors; Pricing 1: 10=0.13400, 100=0.05920, 500=0.03800, 1000=0.03090 (GBP); Mount: Surface Mount; Case/Package: 0603; Number of Pins: 2; Case Code (Metric): 1608; Case Code (Imperial): 0603; Min Operating Temperature: -55°C; Max Operating Temperature: 85°C; Packaging: Tape and Reel; Package Quantity: 4000; Voltage Rating (DC): 25V; Termination: SMD/SMT; Voltage: 25V; Length: 1.6mm; Width: 0.031inch; Height: 0.8mm; Depth: 0.8mm; Thickness: 0.035inch; Radiation Hardening: No; RoHS Compliant: Yes; REACH SVHC: No SVHC; Lead Free: Lead Free
C2 C4-C6 = CMP-06035-036150-1: Cap Ceramic Monolithic 220nF 50V 10% Thru-Hole Bulk; Lead Diameter: 0.5mm; Lead/Base Style: Formed Leads; Dielectric: X7R; Capacitance: 220nF; Width: 0.098inch; Package Quantity: 1; Mount: Through Hole; Voltage Rating: 50V; Voltage Rating (DC): 50V; Height: 3.5mm; Tolerance: 10%; Height - Seated (Max): 0.138inch; Packaging: Tape and Reel; Termination: Radial; Ratings: AEC-Q200; Resistor Type: Ceramic; Lead Pitch: 0.197inch; Max Operating Temperature: 125°C; Min Operating Temperature: -55°C; Case/Package: Radial; Length: 0.157inch
DS1-DS3 = CMP-1744-00002-1: Chip LED, Green, 2.2 V, -40 to 85 degC, 2-Pin SMD, RoHS, Tape and Reel; Frequency: 400 KHz; Max Supply Voltage: 5.5 V; Access Time: 3500 ns; Clock Frequency: 100 KHz; Case\Package: SOIC; Density: 32 kb; Nominal Supply Current: 2 mA; Interface: Serial; Min Supply Voltage: 1.7 V; Packaging: Tape and Reel; PackageReference: HSMX-C190; ComponentLink2URL: http://docs.avagotech.com/docs/AV02-0551EN; RoHSCompliant: true; Pins: 8; REACH SVHC: No SVHC; Max Operating Temperature: 85 degC; Width: 4 mm; Radiation Hardening: No; Package Quantity: 3000; ComponentLink3Description: Package Specification; ComponentLink1Description: Manufacturer URL; Min Operating Temperature: -40 degC; PackageDescription: 2-Pin Surface Mount Device, Body 1.6 x 0.8 mm, Height 0.9 mm; Max Clock Frequency: 100 KHz; Height: 1.5 mm; ComponentLink1URL: http://www.avagotech.com/; DatasheetVersion: Mar-12; ComponentLink2Description: Datasheet; Mount: Surface Mount; Length: 5 mm; ComponentLink3URL: http://www.fairchildsemi.com/dwg/MA/MA03D.pdf
F1-F3 = CMP-08606-000029-1: PTC RESET FUSE 16V 1.1A 1210; Manufacturer: Littelfuse Inc; Trip Time: 0.1s; Value: 0.06-0.21Ω; Trip Current: 2.2A; Current Rating: 100A; Ambient Temperature Range Low: -40°C; Voltage Rating: 16V; ComponentLink2URL: https://www.littelfuse.com/~/media/electronics/datasheets/resettable_ptcs/littelfuse_ptc_1210l_datasheet.pdf.pdf; Device Class L2: PTC Resettable Fuses; Automotive: No; Temperature: -40°C to +85°C; Mouser Description: Resettable Fuses - PPTC 16V 1.10A 1210 PTC; Temperature Range High: +85°C; Manufacturer Part Number: 1210L110/16WR; Temperature Range Low: -40°C; Device Class L1: Circuit Protection; Octopart: https://octopart.com/1210l110%2F16wr-littelfuse-28867107; Lead Free: Yes; Resistance: 0.06-0.21Ω; RoHS: TRUE; Digikey Description: PTC RESET FUSE 16V 1.1A 1210; Package: 0; Height: 1.25mm; Device Class L3: unset; ComponentLink2Description: Datasheet; Ambient Temperature Range High: +85°C
Q1-Q3 = CMP-2000-07455-3: MOSFET P-CH 30V 2A SSOT3; Gate to Source Voltage (Vgs): 20V; Turn-On Delay Time: 6ns; Number of Elements: 1; Max Power Dissipation: 500mW; Rds On Max: 80mR; Input Capacitance: 298pF; Current Rating: -2A; Dual Supply Voltage: -30V; Element Configuration: Single; Turn-Off Delay Time: 11ns; Drain to Source Resistance: 63mR; Rise Time: 13ns; REACH SVHC: No SVHC; Radiation Hardening: No; Packaging: Tape and Reel; Mount: Surface Mount; Height: 0.94mm; Power Dissipation: 500mW; Case/Package: SOT-23; Width: 1.4mm; Continuous Drain Current (ID): 2A; Lead Free: Lead Free; Package Quantity: 1; Drain to Source Voltage (Vdss): 30V; Weight: 0.03g; Voltage Rating (DC): -30V; Threshold Voltage: 20V; On-State Resistance: 80MR; Number of Pins: 3; Drain to Source Breakdown Voltage: -30V; Max Operating Temperature: 150°C; Contact Plating: Tin; Length: 2.92mm; Min Operating Temperature: -55°C; Fall Time: 6ns
R1 R6 R11 = CMP-2100-03667-1: Chip Resistor, 0 Ohm, +/- 5%, 0.1 W, -55 to 155 degC, 0603 (1608 Metric), RoHS, Tape and Reel; Manufacturer: Yageo; Temperature Coefficient: 200ppm/degreesC; Voltage Rating: 50V; Power Rating: 100mW; Width: 0.8mm; Max Operating Temperature: 155degC; Tolerance: 5%; Height: 0.45mm; Depth: 0.8mm; Package Description: 2-Pin Surface Mount Device, Body 1.6 x 0.8 mm; Termination: SMD/SMT; Package Quantity: 5000; Case/Package: 0603; Radiation Hardening: No; Number of Pins: 2; Length: 1.6mm; Lead Free: LeadFree; Voltage Rating (DC): 50V; Military Standard: Not; Datasheet URL: http://www.yageo.com/NewPortal/yageodocoutput?fileName=/pdf/R-Chip/PYu-RC_Group_51_RoHS_L_5.pdf; Manufacturer URL: http://www.yageo.com/; Packaging: TapeandReel; Case Code (Metric): 1608; Min Operating Temperature: -55degC; Composition: ThickFilm; RoHSCompliant: true; Contact Plating: Tin; Datasheet Version: Rev. 5, 10/2016; REACH SVHC: NoSVHC; Supplier 1: Mouser; Supplier Part Number 1: 603-RC0603JR-070RL; Manufacturer Part Number: RC0603JR-070RL; RoHS: Yes; Category: Chip SMD Resistors; Stock 1: 968392; Pricing 1: 1=0,10000, 10=0,01000, 50=0,01000, 100=0,00500, 1000=0,00400, 5000=0,00200, 10000=0,00200 (USD); Size Code: 0603; Resistor Type: Thick Film; Features: Moisture Resistant; Series: RC; Max Power Dissipation: 100mW; Number of Terminations: 2; Construction: Rectangular; Technology: THICK FILM; Resistance Tolerance: 5%; RoHS Compliant: Yes; ComponentLink1URL: https://datasheet.ciiva.com/11808/pyu-r-int-6-11808700.pdf?src-supplier=RSComponents; ComponentLink1Description: https://datasheet.ciiva.com/11808/pyu-r-int-6-11808700.pdf?src-supplier=RSComponents; ComponentLink2URL: https://datasheet.ciiva.com/22747/443971-22747530.pdf?src-supplier=Element14; ComponentLink2Description: https://datasheet.ciiva.com/22747/443971-22747530.pdf?src-supplier=Element14; ComponentLink3URL: https://datasheet.ciiva.com/12555/rc0603-272842-12555254.pdf?src-supplier=Mouser; ComponentLink3Description: https://datasheet.ciiva.com/12555/rc0603-272842-12555254.pdf?src-supplier=Mouser; ComponentLink4URL: https://datasheet.ciiva.com/7746/1738695-7746421.pdf?src-supplier=Element14; ComponentLink4Description: https://datasheet.ciiva.com/7746/1738695-7746421.pdf?src-supplier=Element14; ComponentLink5URL: https://datasheet.ciiva.com/7746/1738695-7746422.pdf?src-supplier=Element14; ComponentLink5Description: https://datasheet.ciiva.com/7746/1738695-7746422.pdf?src-supplier=Element14; ComponentLink6URL: https://datasheet.ciiva.com/8883/pyu-rc0603-51-rohs-l-4-8883045.pdf?src-supplier=Avnet; ComponentLink6Description: https://datasheet.ciiva.com/8883/pyu-rc0603-51-rohs-l-4-8883045.pdf?src-supplier=Avnet; ComponentLink7URL: https://datasheet.ciiva.com/15189/getdatasheetpartid-329462-15189845.pdf?src-supplier=Verical; ComponentLink7Description: https://datasheet.ciiva.com/15189/getdatasheetpartid-329462-15189845.pdf?src-supplier=Verical
R2 R7 R12 = CMP-2000-03816-5: Manufacturer: Vishay Semiconductor; Voltage Rating: 75 V; Package Quantity: 5000; DatasheetVersion: 06/2012; Min Operating Temperature: -55 degC; ComponentLink1URL: http://www.vishay.com/; Mounting Technology: Surface Mount; Height: 0.45 mm; ComponentLink1Description: Manufacturer URL; REACH SVHC: Unknown; PackageReference: 0603; Packaging: Tape and Reel; Max Operating Temperature: 155 degC; Mount: Surface Mount; ComponentLink2Description: Datasheet; PackageDescription: 2-Pin Surface Mount Device, Body 1.575 x 0.85 mm; Length: 1.55 mm; ComponentLink2URL: http://www.vishay.com/docs/20035/dcrcwe3.pdf; Pins: 2; RoHSCompliant: true
R3 R8 R13 = CMP-1012-00623-3: Chip Resistor, 10 KOhm, +/- 1%, 0.1 W, -55 to 155 degC, 0603 (1608 Metric), RoHS, Tape and Reel; Manufacturer: Panasonic; Manufacturer Part Number: ERJ-3EKF1002V; Voltage Rating: 75V; Power Rating: 100mW; Temperature Coefficient: 100ppm\/degreesC; Case\/Package: 0603; Number of Pins: 2; Package Reference: 603; Depth: 0.8mm; Mount: SurfaceMount; Package Description: 2-Pin Surface Mount Device, Body 1.6 x 0.85 mm; Datasheet Version: 02/2017; Length: 1.6mm; Lead Free: LeadFree; Height: 0.45mm; Number of Terminations: 2; Max Power Dissipation: 100mW; Min Operating Temperature: -55degC; Datasheet URL: https://industrial.panasonic.com/cdbs/www-data/pdf/RDA0000/AOA0000C304.pdf; Termination: SMD/SMT; Case Code (Metric): 1608; Tolerance: 1%; Max Operating Temperature: 155degC; RoHSCompliant: true; Voltage Rating (DC): 75V; Radiation Hardening: No; Packaging: TapeandReel; Composition: ThickFilm; Mounting Technology: SurfaceMount; Manufacturer URL: http://www.panasonic.com/; Width: 0.031inch; REACH SVHC: NoSVHC; Contact Plating: Tin; Military Standard: Not; Package Quantity: 1; Supplier 1: Mouser; Supplier Part Number 1: 667-ERJ-3EKF1002V; RoHS: Yes; Category: Chip SMD Resistors; Stock 1: 20455; Pricing 1: 1=0,10000, 10=0,04000, 50=0,04000, 100=0,01700, 1000=0,00700, 5000=0,00500, 10000=0,00500 (USD); Case/Package: 0603; Size Code: 0603; Resistor Type: Thick Film; Series: ERJ; Resistance Tolerance: 1%; Construction: Rectangular; Features: Automotive AEC-Q200; Technology: THICK FILM; RoHS Compliant: Yes; ComponentLink1URL: https://datasheet.ciiva.com/16511/aoa0000ce2-16511861.pdf?src-supplier=Avnet+Asia; ComponentLink1Description: https://datasheet.ciiva.com/16511/aoa0000ce2-16511861.pdf?src-supplier=Avnet+Asia; ComponentLink2URL: https://datasheet.ciiva.com/46372/1678782-46372725.pdf?src-supplier=Element14; ComponentLink2Description: https://datasheet.ciiva.com/46372/1678782-46372725.pdf?src-supplier=Element14; ComponentLink3URL: https://datasheet.ciiva.com/28514/426256-28514198.pdf?src-supplier=Element14; ComponentLink3Description: https://datasheet.ciiva.com/28514/426256-28514198.pdf?src-supplier=Element14; ComponentLink4URL: https://datasheet.ciiva.com/9194/aoa0000ce2-9194199.pdf?src-supplier=Avnet; ComponentLink4Description: https://datasheet.ciiva.com/9194/aoa0000ce2-9194199.pdf?src-supplier=Avnet; ComponentLink5URL: https://datasheet.ciiva.com/7830/aoa0000ce2-7830729.pdf?src-supplier=Element14; ComponentLink5Description: https://datasheet.ciiva.com/7830/aoa0000ce2-7830729.pdf?src-supplier=Element14; ComponentLink6URL: https://datasheet.ciiva.com/17212/aoa0000ce2-17212105.pdf?src-supplier=Avnet+Europe; ComponentLink6Description: https://datasheet.ciiva.com/17212/aoa0000ce2-17212105.pdf?src-supplier=Avnet+Europe; ComponentLink7URL: https://datasheet.ciiva.com/30208/aoa0000ce2-30208985.pdf?src-supplier=Onlinecomponents.com; ComponentLink7Description: https://datasheet.ciiva.com/30208/aoa0000ce2-30208985.pdf?src-supplier=Onlinecomponents.com; ComponentLink8URL: https://datasheet.ciiva.com/48530/aoa0000ce2-48530988.pdf?src-supplier=Avnet; ComponentLink8Description: https://datasheet.ciiva.com/48530/aoa0000ce2-48530988.pdf?src-supplier=Avnet; ComponentLink9URL: https://datasheet.ciiva.com/24070/aoa0000ce2-24070318.pdf?src-supplier=Mouser; ComponentLink9Description: https://datasheet.ciiva.com/24070/aoa0000ce2-24070318.pdf?src-supplier=Mouser; ComponentLink10URL: https://datasheet.ciiva.com/16759/70260748-16759807.pdf?src-supplier=Allied+Electronics; ComponentLink10Description: https://datasheet.ciiva.com/16759/70260748-16759807.pdf?src-supplier=Allied+Electronics
R4 R9 R14 = CMP-2000-00317-1: Manufacturer: Panasonic; Power Rating: 100mW; Tolerance: 1%; Voltage Rating: 75V; Temperature Coefficient: 100ppm/°C; Voltage Rating (DC): 50V; Part Number: ERJ-3EKF2001V; Supplier 1: Mouser; Supplier Part Number 1: 667-ERJ-3EKF2001V; Manufacturer Part Number: ERJ-3EKF2001V; RoHS: Yes; Category: Chip SMD Resistors; Stock 1: 44455; Pricing 1: 1=0,10000, 10=0,03200, 50=0,03200, 100=0,01500, 1000=0,00700, 10000=0,00400 (USD); Mount: Surface Mount; Case/Package: 0603; Case Code (Metric): 1608; Contact Plating: Tin; Size Code: 0603; Min Operating Temperature: -55°C; Max Operating Temperature: 155°C; Packaging: Tape and Reel; Package Quantity: 1; Resistor Type: Thick Film; Number of Terminations: 2; Termination: SMD/SMT; Max Power Dissipation: 100mW; Series: ERJ; Resistance Tolerance: 1%; Construction: Rectangular; Features: Automotive AEC-Q200; Length: 1.6mm; Width: 0.031inch; Height: 0.022inch; Depth: 0.8mm; Radiation Hardening: No; REACH SVHC: No SVHC; Military Standard: Not; Lead Free: Lead Free; RoHS Compliant: Yes; ComponentLink1URL: https://datasheet.ciiva.com/43460/1678782-43460485.pdf?src-supplier=Farnell; ComponentLink1Description: https://datasheet.ciiva.com/43460/1678782-43460485.pdf?src-supplier=Farnell; ComponentLink2URL: https://datasheet.ciiva.com/6082/1678782-6082059.pdf?src-supplier=Farnell; ComponentLink2Description: https://datasheet.ciiva.com/6082/1678782-6082059.pdf?src-supplier=Farnell; ComponentLink3URL: https://datasheet.ciiva.com/46377/1678782-46377366.pdf?src-supplier=Element14; ComponentLink3Description: https://datasheet.ciiva.com/46377/1678782-46377366.pdf?src-supplier=Element14; ComponentLink4URL: https://datasheet.ciiva.com/28673/1678782-28673990.pdf?src-supplier=Element14; ComponentLink4Description: https://datasheet.ciiva.com/28673/1678782-28673990.pdf?src-supplier=Element14; ComponentLink5URL: https://datasheet.ciiva.com/24027/aoa0000ce2-24027453.pdf?src-supplier=Mouser; ComponentLink5Description: https://datasheet.ciiva.com/24027/aoa0000ce2-24027453.pdf?src-supplier=Mouser; ComponentLink6URL: https://datasheet.ciiva.com/16771/70260748-16771369.pdf?src-supplier=Allied+Electronics; ComponentLink6Description: https://datasheet.ciiva.com/16771/70260748-16771369.pdf?src-supplier=Allied+Electronics; ComponentLink7URL: https://datasheet.ciiva.com/16200/aoa0000ce2-16200501.pdf?src-supplier=Future+Electronics; ComponentLink7Description: https://datasheet.ciiva.com/16200/aoa0000ce2-16200501.pdf?src-supplier=Future+Electronics; ComponentLink8URL: https://datasheet.ciiva.com/30064/aoa0000ce2-30064920.pdf?src-supplier=Onlinecomponents.com; ComponentLink8Description: https://datasheet.ciiva.com/30064/aoa0000ce2-30064920.pdf?src-supplier=Onlinecomponents.com; ComponentLink9URL: https://datasheet.ciiva.com/17214/aoa0000ce2-17214393.pdf?src-supplier=Avnet+Europe; ComponentLink9Description: https://datasheet.ciiva.com/17214/aoa0000ce2-17214393.pdf?src-supplier=Avnet+Europe
U1 U2 = CMP-0062-02476-3: Series 3-Terminal Positive Regulators, 3-pin TO-220; Manufacturer: Texas Instruments; PowerWise: N; PackageTopMarking: NSUZXYTTE#*LM340AT*5.0 P+; CompType: LDO IC; PinCount: 3; PackageDescription: TO-220, Molded, 3 Lead, Straight; ComponentLink1URL: http://www.ti.com/general/docs/lit/getliterature.tsp?genericPartNumber=LM340-N&fileType=pdf; PackageReference: NDE0003A; ComponentLink1Description: Datasheet URL; RoHS: N